# Altium schematic sheet Sch.SchDoc
size A
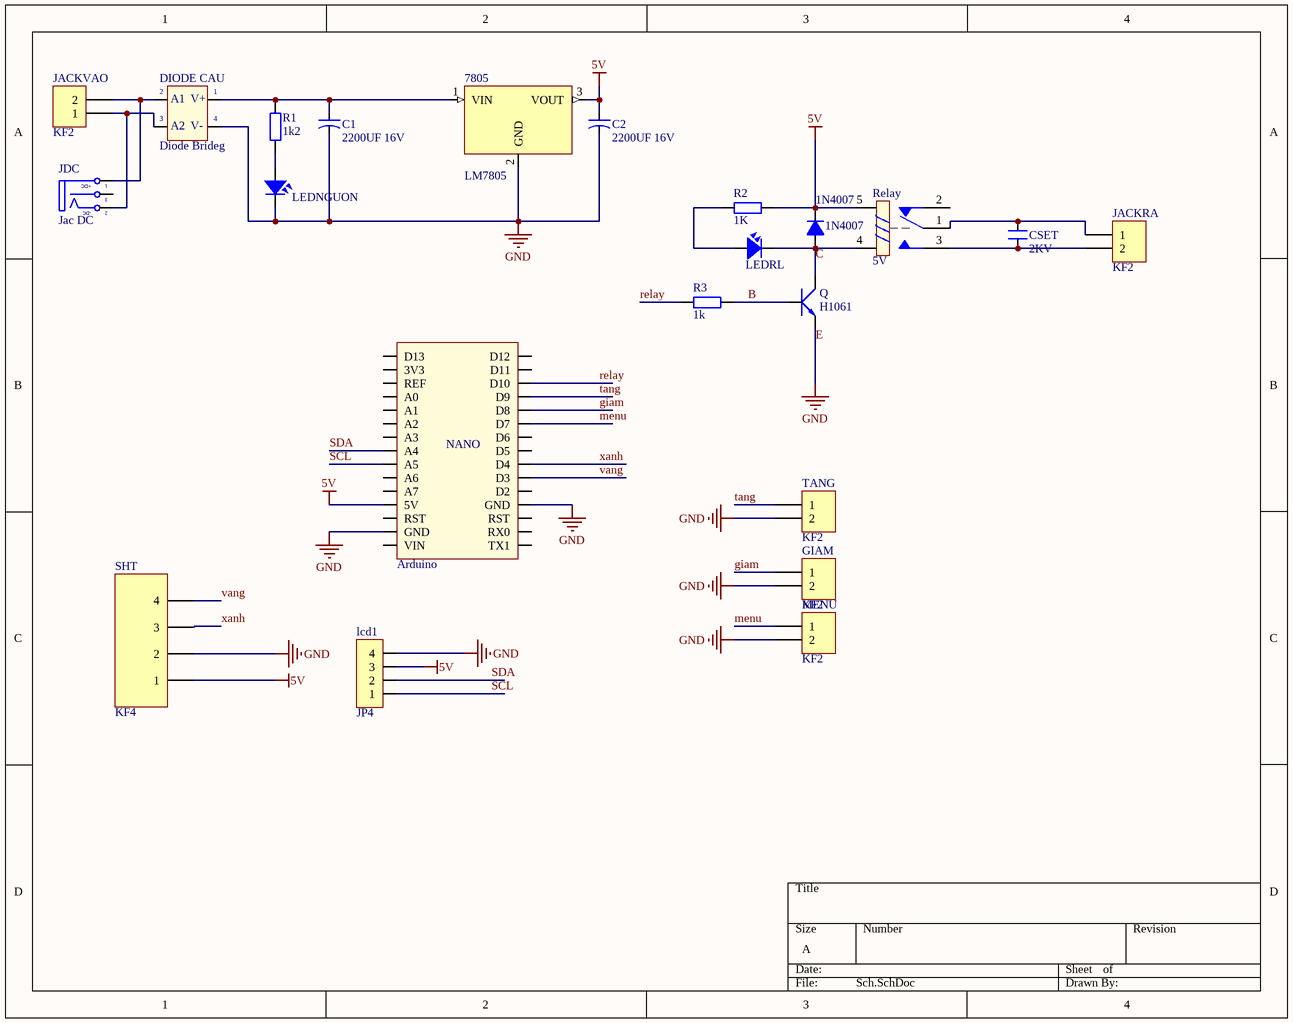
[diagram p0: Sch.SchDoc]

## Parts
1N4007  1N4007  [D1A]
7805  LM7805  [QTO-220H3]
Arduino  Arduino Nano  [Arduino Nano]  (value not drawn)
C1  2200UF 16V  [CA-ALU-8]
C2  2200UF 16V  [CA-ALU-8]
CSET  2KV  [CN2.5]
DIODE_CAU  Diode Brideg  [DIO-Bri 5A]
GIAM  KF2  [KF2-3.5]
JACKRA  KF2  [KF2-5.08]
JACKVAO  KF2  [KF2-3.5]
JDC  Jac DC  [DC0]
lcd1  JP4  [JP4-C1T]
LEDNGUON  LED  [LED-5-BLUE]  (value not drawn)
LEDRL  LED  [LED-5-RED]  (value not drawn)
MENU  KF2  [KF2-3.5]
Q  H1061  [QTO-220]
R1  1k2  [R1/4W]
R2  1K  [R1/4W]
R3  1k  [R1/4W]
Relay  5V  [RELAY 5]
SHT  KF4  [KF4-5.08]
TANG  KF2  [KF2-3.5]

## Nets
5V: 1N4007.2(K) 7805.3(VOUT) Arduino.5V C2.1 lcd1.3 R2.2 Relay.5 SHT.1
E: 7805.2(GND) Arduino.GND C1.2 C2.2 DIODE_CAU.4(-V_OUT) GIAM.2 lcd1.4 LEDNGUON.2 MENU.2 Q.3(E) SHT.2 TANG.2  [also labelled GND]
B: Q.1(B) R3.2
C: 1N4007.1(A) LEDRL.2 Q.2(C) Relay.4
giam: Arduino.D8 GIAM.1
menu: Arduino.D7 MENU.1
relay: Arduino.D10 R3.1
SCL: Arduino.A5 lcd1.1
SDA: Arduino.A4 lcd1.2
tang: Arduino.D9 TANG.1
vang: Arduino.D3 SHT.4
xanh: Arduino.D4 SHT.3
Net7805_1: 7805.1(VIN) C1.1 DIODE_CAU.1(+V_OUT) R1.2
NetCSET_1: CSET.1 JACKRA.2 Relay.3
NetCSET_2: CSET.2 JACKRA.1 Relay.1
NetDIODE_CAU_2: DIODE_CAU.2(AC1) JACKVAO.2 JDC.1(T)
NetDIODE_CAU_3: DIODE_CAU.3(AC2) JACKVAO.1 JDC.2(TN)
NetLEDNGUON_1: LEDNGUON.1 R1.1
NetLEDRL_1: LEDRL.1 R2.1

Not connected (* = marked no-connect by the designer): Arduino 3V3 A0 A1 A2 A3 A6 A7 D2 D5 D6 D11 D12 D13 REF RST RX0 TX1 VIN; JDC 3(S); Relay 2

## Notes on the sheet
- (in symbol Arduino Nano) NANO
- (in symbol DCIN) +DC; -DC
- (in symbol DIODE BRIGDE) A1; V+; A2; V-

## Library data of the parts
1N4007 = D1A: Diode 1A; Value: 1N4007
7805 = LM7805: TO-220; Text Field1: 70; Text Field2: 30
Arduino = Arduino Nano: Value: Cau 1A
C1 C2 = CN-ALU-DIP: Capacitor (Semiconductor SIM Model); Value: 104; LatestRevisionDate: 17-Jul-2002; LatestRevisionNote: Re-released for DXP Platform.; PackageReference: C1206; Publisher: Altium Limited
CSET = CN: Value: 33pF
DIODE_CAU = DIODE BRIGDE: Convert AC to DC voltage, 4 pin; Value: Cau 1A
GIAM JACKRA JACKVAO MENU TANG = KF2: Manufacturer: Würth Elektronik eiSos GmbH; partNo: 691103110002; ComponentLink1 Description: Manufacturer; ComponentLink2 Description: Datasheet; NoPins: 2; Created Date: 29 October 2013; ComponentLink1URL: http://www.we-online.com; ComponentLink2URL: http://katalog.we-online.de/em/datasheet/6911031100xx.pdf; Created by: Karrer Zheng
JDC = DCIN: Jac DC input; Value: Jac DC
lcd1 = JP4: WR-PHD 2.54 mm Angled Socket Header; Manufacturer: W¨¹rth Elektronik eiSos GmbH; partNo: 613004143121; ComponentLink1 Description: Manufacturer; ComponentLink2 Description: Datasheet; NoPins: 04; Created Date: 29 March 2013; ComponentLink1URL: http://www.we-online.com; ComponentLink2URL: http://katalog.we-online.de/em/datasheet/6130xx143121.pdf; Created by: Karrer Zheng
LEDNGUON LEDRL = LED: LED Single colour Green and Red; Value: LED 3 ly Single Colour
Q = NPN_BCE: P 1W, BCE; Value: TIP41
R1-R3 = R1/4W: Resistor 1/4W; Value: R1/4W - 1K
Relay = Relay 5: Relay SPDT,10A - 12VDC 5 Pin; Value: Relay SPDT, 10A, 12V
SHT = KF4: Manufacturer: W¨¹rth Elektronik eiSos GmbH; PartNo: 691133710004; ComponentLink1 Description: Manufacturer; ComponentLink2 Description: Datasheet; NoPins: 4; ComponentLink1 URL: http://www.we-online.com; ComponentLink2 URL: http://katalog.we-online.de/em/datasheet/6911337100xx.pdf; Created By: Baojun Chen; Created Date: 4-Aug-15